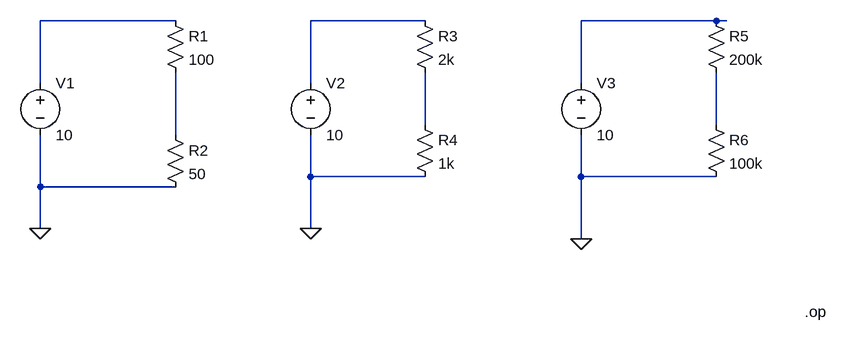
[diagram p0: schematic PreLab 2 pt 2.asc]
PreLab 2 pt 2.asc, the LTspice schematic file:
Version 4
SHEET 1 1084 680
WIRE 80 128 -128 128
WIRE 464 128 288 128
WIRE 912 128 704 128
WIRE 928 128 912 128
WIRE -128 224 -128 128
WIRE 288 224 288 128
WIRE 704 224 704 128
WIRE 464 288 464 208
WIRE 912 288 912 208
WIRE 80 304 80 208
WIRE 288 368 288 304
WIRE 464 368 288 368
WIRE 704 368 704 304
WIRE 912 368 704 368
WIRE -128 384 -128 304
WIRE 80 384 -128 384
WIRE -128 448 -128 384
WIRE 288 448 288 368
WIRE 704 464 704 368
FLAG -128 448 0
FLAG 288 448 0
FLAG 704 464 0
SYMBOL res 64 112 R0
SYMATTR InstName R1
SYMATTR Value 100
SYMBOL res 64 288 R0
SYMATTR InstName R2
SYMATTR Value 50
SYMBOL res 448 112 R0
SYMATTR InstName R3
SYMATTR Value 2k
SYMBOL res 448 272 R0
SYMATTR InstName R4
SYMATTR Value 1k
SYMBOL res 896 112 R0
SYMATTR InstName R5
SYMATTR Value 200k
SYMBOL res 896 272 R0
SYMATTR InstName R6
SYMATTR Value 100k
SYMBOL voltage -128 208 R0
SYMATTR InstName V1
SYMATTR Value 10
SYMATTR SpiceLine Rser=50
SYMBOL voltage 288 208 R0
SYMATTR InstName V2
SYMATTR Value 10
SYMATTR SpiceLine Rser=50
SYMBOL voltage 704 208 R0
SYMATTR InstName V3
SYMATTR Value 10
SYMATTR SpiceLine Rser=50
TEXT 1048 576 Left 2 !.op

The netlist it stands for:
* PreLab 2 pt 2.asc
R1 N001 N006 100
R2 N006 0 50
R3 N002 N004 2k
R4 N004 0 1k
R5 N003 N005 200k
R6 N005 0 100k
V1 N001 0 10 Rser=50
V2 N002 0 10 Rser=50
V3 N003 0 10 Rser=50
.op
.backanno
.end